# EAGLE design SparkFun_MicroPressure_Sensor (EAGLE 9.6.0)
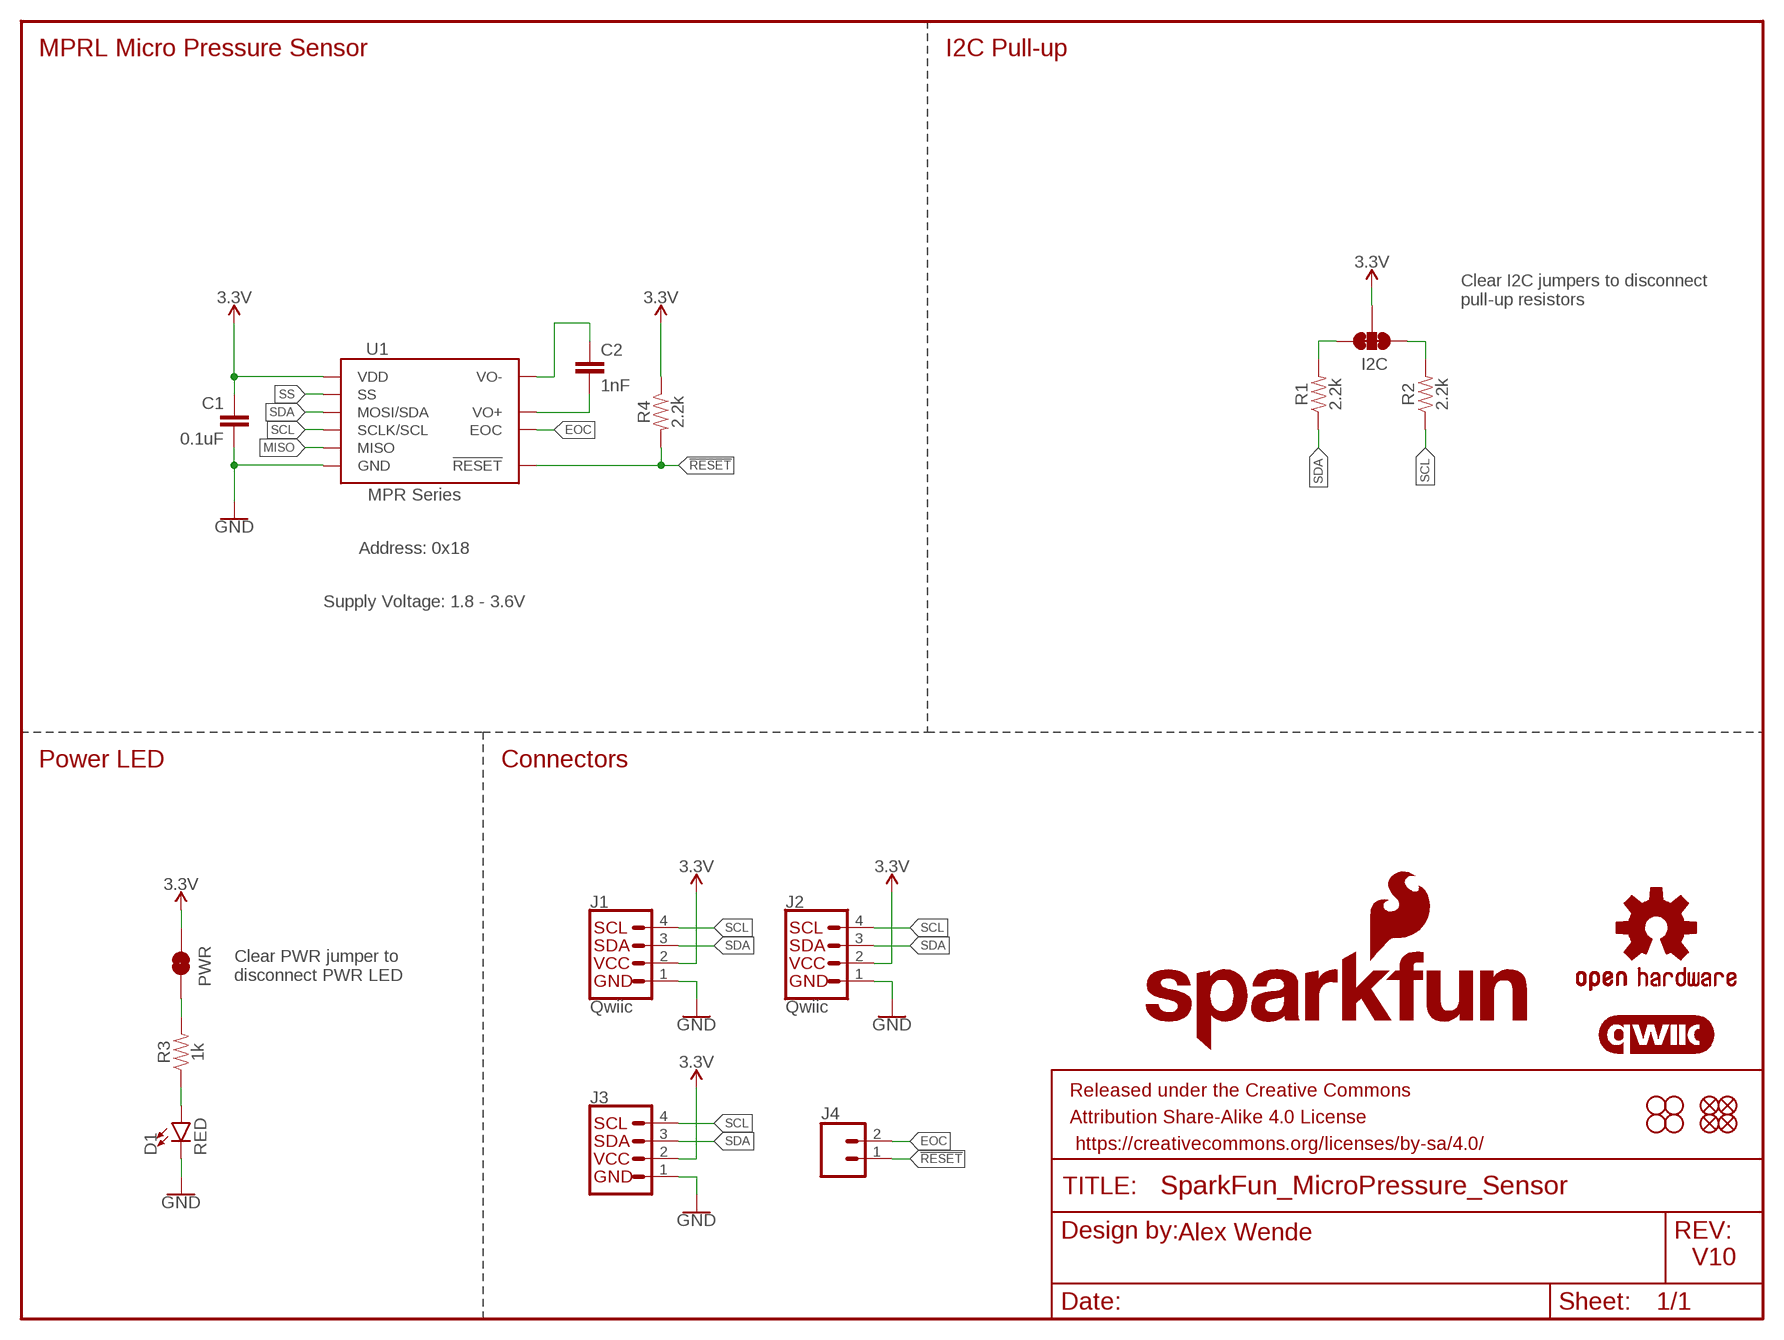
[diagram p0: schematic, sheet 1]

## Parts
C1  0.1uF  0.1UF-0603-25V-(+80/-20%)  [0603]
C2  1nF  1.0NF/1000PF-0603-50V-10%  [0603]
D1  RED  LED-RED0603  [LED-0603]
FD1  FIDUCIALUFIDUCIAL  [FIDUCIAL-MICRO]
FD2  FIDUCIALUFIDUCIAL  [FIDUCIAL-MICRO]
FD3  FIDUCIALUFIDUCIAL  [FIDUCIAL-MICRO]
FD4  FIDUCIALUFIDUCIAL  [FIDUCIAL-MICRO]
FRAME1  FRAME-LETTER  [CREATIVE_COMMONS]
H1  STAND-OFF  [STAND-OFF]
H2  STAND-OFF  [STAND-OFF]
H3  STAND-OFF  [STAND-OFF]
H4  STAND-OFF  [STAND-OFF]
I2C  JUMPER-SMT_3_2-NC_TRACE_SILK  [SMT-JUMPER_3_2-NC_TRACE_SILK]
J1  Qwiic  I2C_STANDARDQWIIC  [JST04_1MM_RA]
J2  Qwiic  I2C_STANDARDQWIIC  [JST04_1MM_RA]
J3  I2C_STANDARD_NO_SILK  [1X04_NO_SILK]
J4  CONN_021X02_NO_SILK  [1X02_NO_SILK]
LOGO1  QWIIC_LOGO_5MM  [QWIIC_5MM]
LOGO2  OSHW-LOGOS  [OSHW-LOGO-S]
LOGO3  SFE_LOGO_NAME_FLAME.1_INCH  [SFE_LOGO_NAME_FLAME_.1]
PWR  JUMPER-SMT_2_NC_TRACE_SILK  [SMT-JUMPER_2_NC_TRACE_SILK]
R1  2.2k  2.2KOHM-0603-1/10W-1%  [0603]
R2  2.2k  2.2KOHM-0603-1/10W-1%  [0603]
R3  1k  1KOHM-0603-1/10W-1%  [0603]
R4  2.2k  2.2KOHM-0603-1/10W-1%  [0603]
U1  MPR Series  MPR_SERIES_PRESSURE_I2C  [MPR_SERIES_PRESSURE_I2C]

## Nets
3.3V: C1.1 I2C.2 J1.2 J2.2 J3.2 PWR.1 R4.1 U1.12(VDD)
!RESET: J4.1 R4.2 U1.9(!RESET)
EOC: J4.2 U1.8(EOC)
GND: C1.2 D1.C J1.1 J2.1 J3.1 U1.10(GND)
MISO: U1.7(MISO)
N$1: PWR.2 R3.2
N$2: D1.A R3.1
N$3: I2C.1 R2.2
N$4: I2C.3 R1.2
N$6: C2.2 U1.4(VO+)
N$7: C2.1 U1.6(VO-)
SCL: J1.4 J2.4 J3.4 R2.1 U1.3(SCLK/SCL)
SDA: J1.3 J2.3 J3.3 R1.1 U1.2(MOSI/SDA)
SS: U1.1(SS)

## Notes on the sheet
- MPRL Micro Pressure Sensor | I2C Pull-up
- Clear I2C jumpers to disconnect
  pull-up resistors
- Address: 0x18
- Supply Voltage: 1.8 - 3.6V
- Power LED | Connectors
- Clear PWR jumper to
  disconnect PWR LED
- Alex Wende
- V10

## Library data of the parts
C1 = SparkFun-Capacitors:0.1UF: 0.1µF ceramic capacitors A capacitor is a passive two-terminal electrical component used to store electrical energy temporarily in an electric field.; PROD_ID: CAP-00810
C2 = SparkFun-Capacitors:1.0NF/1000PF: 1nF/1,000pF ceramic capacitors A capacitor is a passive two-terminal electrical component used to store electrical energy temporarily in an electric field.; PROD_ID: CAP-07886
D1 = SparkFun-LED:LED-RED: Red SMD LED Used in manufacturing of most products at SparkFun Packages: 0603 - SMD 0603 package [Product Link] <http://docs.avagotech.com/docs/AV02-0551EN> 0603 SMART - SMD 0603 SMART package ( more efficient and expensive)[Product Link] <http://www.osram-os.com/Graphics/XPic2/00077099_0.pdf> 1206 - SMD1206 package [Product Link] <https://www.sparkfun.com/datasheets/DevTools/LilyPad/Q150OVS4.pdff> SparkFun Products: Pro Mini 328 -5V <https://www.sparkfun.com/products/821> RedBoard <https://www.sparkfun.com/products/12757> IOIO-OTG <https://www.sparkfun.com/products/13613>; PROD_ID: DIO-00819
FD1-FD4 = SparkFun-Aesthetics:FIDUCIAL: Fiducial Alignment Points Point-of-reference for pick-and-place machines and other optical instruments.
FRAME1 = SparkFun-Aesthetics:FRAME-LETTER: Schematic Frame - Letter Standard 8.5x11 US Letter frame
H1-H4 = SparkFun-Hardware:STAND-OFF: Stand Off Drill holes for mechanically mounting via screws, standoffs, etc. Note: Use the keepout ring to avoid running the screw head into surrounding components. Variant Overviews STAND-OFF - Mechanical footprint for a #4 phillips button head screw. STAND-OFF-TIGHT - Mechanical footprint for a #4 phillips button head screw, Example SparkFun Products Screw - Phillips Head (1/4", 4-40, 10 pack) <https://www.sparkfun.com/products/10453> (PRT-10453) Screw - Phillips Head (1/2", 4-40, 10 pack) <https://www.sparkfun.com/products/10452> (PRT-10452) Screw - Phillips Head (3/4", 4-40, 10 pack) <https://www.sparkfun.com/products/10451> (PRT-10451) Screw - Phillips Head (1", 4-40, 10 pack) <https://www.sparkfun.com/products/10450> (PRT-10450)
I2C = SparkFun-Jumpers:JUMPER-SMT_3_2-NC_TRACE: Normally closed trace jumper (2 of 2 connections) This jumper has a trace between all three pads so they are normally closed (NC). Use a razor knife to open the connection(s). For best results follow the IPC guidelines for cutting traces: Cutout at least 0.063 mm (0.005 in). Remove all loose material to clean up the cut area. Seal the cut with an approved epoxy. Reapply solder to reclose the connection(s).
J1 J2 = SparkFun-Connectors:I2C_STANDARD: SparkFun I2C Standard Pinout Header SparkFun has standardized on a pinout for all I2C based sensor breakouts. This pinout allows I2C boards to be plugged directly into the headers on Arduino Uno compatible boards, and to be daisy chained easily. Example SparkFun Products: SparkFun Atmospheric Sensor Breakout - BME280 <https://www.sparkfun.com/products/13676> SparkFun Altitude/Pressure Sensor Breakout - MPL3115A2 <https://www.sparkfun.com/products/11084> SparkFun TOF Range Finder Sensor - VL6180 <https://www.sparkfun.com/products/12785>; PROD_ID: CONN-13694; VALUE: Qwiic Right Angle
J3 = SparkFun-Connectors:I2C_STANDARD: SparkFun I2C Standard Pinout Header SparkFun has standardized on a pinout for all I2C based sensor breakouts. This pinout allows I2C boards to be plugged directly into the headers on Arduino Uno compatible boards, and to be daisy chained easily. Example SparkFun Products: SparkFun Atmospheric Sensor Breakout - BME280 <https://www.sparkfun.com/products/13676> SparkFun Altitude/Pressure Sensor Breakout - MPL3115A2 <https://www.sparkfun.com/products/11084> SparkFun TOF Range Finder Sensor - VL6180 <https://www.sparkfun.com/products/12785>
J4 = SparkFun-Connectors:CONN_02: Multi connection point. Often used as Generic Header-pin footprint for 0.1 inch spaced/style header connections On any of the 0.1 inch spaced packages, you can populate with these: Break Away Headers - Straight <https://www.sparkfun.com/products/116> (PRT-00116) Break Away Male Headers - Right Angle <https://www.sparkfun.com/products/553> (PRT-00553) Female Headers <https://www.sparkfun.com/products/115> (PRT-00115) Break Away Headers - Machine Pin <https://www.sparkfun.com/products/117> (PRT-00117) Break Away Female Headers - Swiss Machine Pin <https://www.sparkfun.com/products/743> (PRT-00743) For SCREWTERMINALS and SPRING TERMINALS visit here: Screw Terimnals on SparkFun.com <https://www.sparkfun.com/search/results?term=Screw+Terminals> (5mm/3.5mm/2.54mm spacing) This device is also useful as a general connection point to wire up your design to another part of your project. Our various solder wires solder well into these plated through hole pads. Hook-Up Wire - Assortment (Stranded, 22 AWG) <https://www.sparkfun.com/products/11375> (PRT-11375) Hook-Up Wire - Assortment (Solid Core, 22 AWG) <https://www.sparkfun.com/products/11367> (PRT-11367) View the entire wire category on our website here <https://www.sparkfun.com/categories/141> Special notes: Molex polarized connector foot print use with: PRT-08233 with associated crimp pins and housings. 2.54_SCREWTERM for use with PRT-10571. 3.5mm Screw Terminal footprints for PRT-08084 5mm Screw Terminal footprints for use with PRT-08432
LOGO1 = SparkFun-Aesthetics:QWIIC_LOGO: Qwiic Logos for placement on schematic and PCB. The 5.5mm silk logo is best for placing next to Qwiic connector.
LOGO2 = SparkFun-Aesthetics:OSHW-LOGO: Open-Source Hardware (OSHW) Logo This logo indicates the piece of hardware it is found on incorporates a OSHW license and/or adheres to the definition of open source hardware found here: http://freedomdefined.org/OSHW
LOGO3 = SparkFun-Aesthetics:SFE_LOGO_NAME_FLAME: SparkFun Font Logo w/ Flame This is the SparkFun full logo. The logo on the schematic will always be the same size; the package variant is the height of the flame part of the logo. Default layer for the logo on the board is tSilk.
PWR = SparkFun-Jumpers:JUMPER-SMT_2_NC_TRACE: Normally closed trace jumper This jumper has a trace between two pads so it's normally closed (NC). Use a razor knife to open the connection. For best results follow the IPC guidelines for cutting traces: Cutout at least 0.063 mm (0.005 in). Remove all loose material to clean up the cut area. Seal the cut with an approved epoxy. Reapply solder to reclose the connection.
R1 R2 R4 = SparkFun-Resistors:2.2KOHM: 2.2kΩ resistor A resistor is a passive two-terminal electrical component that implements electrical resistance as a circuit element. Resistors act to reduce current flow, and, at the same time, act to lower voltage levels within circuits. - Wikipedia; PROD_ID: RES-08272
R3 = SparkFun-Resistors:1KOHM: 1kΩ resistor A resistor is a passive two-terminal electrical component that implements electrical resistance as a circuit element. Resistors act to reduce current flow, and, at the same time, act to lower voltage levels within circuits. - Wikipedia; PROD_ID: RES-07856
U1 = SparkFun-Sensors:MPR_SERIES_PRESSURE_I2C; PROD_ID: IC-15069

## Board
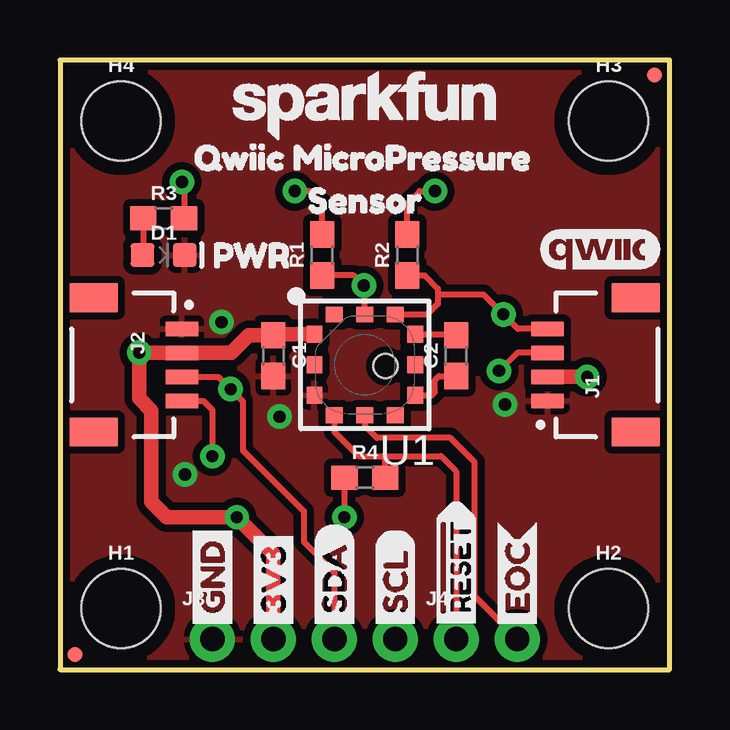
[diagram p1: board, top side]
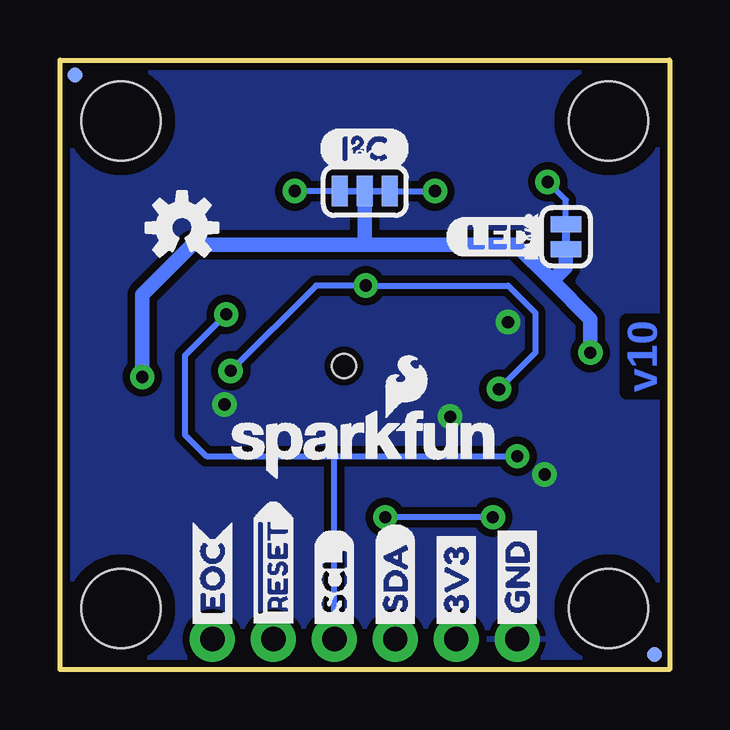
[diagram p2: board, bottom side, seen from below]

Size 25.4 x 25.4 mm. Coordinates in mm from the lower left corner, seen from the top.
Outline: 0,0 25.4,0 25.4,25.4 0,25.4 0,0
Copper layers (1*16): Top 0.035mm / dielectric 1.5mm / Bottom 0.035mm
Design rules "SparkFun-2-layer-STANDARD": minimum track width 10mil, minimum drill 20mil, track to track 10mil, track to pad 8mil, pad to pad 8mil, via to via 10mil, smd to smd 8mil, copper to edge 8mil, drill to drill 8mil, minimum pad ring 10mil, minimum via ring 10mil, stop-mask expansion 4mil, vias tented up to drill 25mil, thermal gap 10mil

### Footprints (pad centres in the part's own frame; a part is rotated, then mirrored left to right if it is on the bottom)
0603 = smd 1.1 x 1: 1 -0.85,0; 2 0.85,0
LED-0603 = smd 1 x 1: A -0.877,0; C 0.877,0
FIDUCIAL-MICRO = smd 0.635 x 0.635: 1 0,0
STAND-OFF = hole 3.302: 0,0
SMT-JUMPER_3_2-NC_TRACE_SILK = smd 0.66 x 1.27: 1 -1.041,0; 2 0,0; 3 1.041,0
JST04_1MM_RA = smd 0.6 x 1.35: 1 -1.5,0; 2 -0.5,0; 3 0.5,0; 4 1.5,0 | smd 1.2 x 2: NC1 2.8,-3.675; NC2 -2.8,-3.675
1X04_NO_SILK = drill 1.016 pad 1.88: 1 0,0; 2 2.54,0; 3 5.08,0; 4 7.62,0
1X02_NO_SILK = drill 1.016 pad 1.88: 1 0,0; 2 2.54,0
SMT-JUMPER_2_NC_TRACE_SILK = smd 0.66 x 1.27: 1 -0.521,0; 2 0.521,0
MPR_SERIES_PRESSURE_I2C = smd 0.7 x 0.65: 1 1.27,-2.1; 2 0,-2.1; 3 -1.27,-2.1; 7 -1.27,2.1; 8 0,2.1; 9 1.27,2.1 | smd 0.65 x 0.7: 4 -2.1,-1.27; 5 -2.1,0; 6 -2.1,1.27; 10 2.1,1.27; 11 2.1,0; 12 2.1,-1.27 | hole 1: -0.86,0.05

### Placement (x,y rotation side)
C1  8.89,13.08 270 top
C2  16.51,13.08 90 top
D1  4.32,17.27 0 top
FD1  0.64,0.64 0 top
FD2  0.64,0.64 0 bottom
FD3  24.77,24.77 0 bottom
FD4  24.77,24.77 0 top
FRAME1  -12.7,-17.78 0 top  (outside the outline)
H1  2.54,2.54 0 top
H2  22.86,2.54 0 top
H3  22.86,22.86 0 top
H4  2.54,22.86 0 top
I2C  12.7,19.94 0 bottom
J1  20.32,12.7 90 top
J2  5.08,12.7 270 top
J3  6.35,1.27 0 top
J4  16.51,1.27 0 top
LOGO1  22.48,17.53 0 top
LOGO2  20.32,18.41 0 bottom
LOGO3  12.7,9.4 0 bottom
PWR  4.32,18.03 90 bottom
R1  10.92,17.27 90 top
R2  14.48,17.27 90 top
R3  4.32,18.8 0 top
R4  12.7,8 0 top
U1  12.7,12.7 180 top
U$1  [GND1]  6.35,1.44 90 top
U$2  [3V30]  8.89,1.4 90 top
U$3  [SDA2]  11.43,1.44 90 top
U$4  [SCL3]  13.97,1.44 90 top
U$5  [#RESET4]  16.51,1.28 90 top
U$6  [EOC5]  19.05,1.4 90 top
U$7  [PWR0]  5.46,17.27 0 top
U$8  [LED7]  9.4,18.03 0 bottom
U$9  [I#C0]  14.61,21.72 0 bottom
U$10  [EOC5]  19.05,1.4 90 bottom
U$11  [#RESET4]  16.51,1.28 90 bottom
U$12  [SCL3]  13.97,1.44 90 bottom
U$13  [SDA2]  11.43,1.44 90 bottom
U$14  [3V30]  8.89,1.4 90 bottom
U$15  [GND1]  6.35,1.44 90 bottom
U$16  [QWIIC_MICROPRESSURE0]  4.7,21.34 0 top
U$18  [SENSOR2]  9.4,19.56 0 top
U$19  [SFE_LOGO_NAME_.1]  12.7,23.5 0 top

### Tracks (layer width: path | path; a pad name or v marks a point on that pad's centre or on a via)
3.3V  (via drill 0.51)
  Top 0.254: R4.1 v11.85,6.35
  Top 0.61: J1.2 v21.97,12.2 v21.97,12.19 | J3.2 8.89,4.83 v7.37,6.35 4.45,6.35 3.81,6.99 3.81,10.79 3.3,11.3 v3.3,13.21 v3.3,13.2 J2.2 7.14,13.2 7.87,13.93 C1.1 8.93,13.97 U1.12
  Bottom 0.254: v7.37,6.35 v11.85,6.35
  Bottom 0.61: v21.97,12.19 21.97,15.62 19.89,17.7 12.7,17.7 | 12.7,17.7 6.4,17.7 4.89,16.19 | 4.89,16.19 3.3,14.61 v3.3,13.21 | I2C.2 12.7,17.7 | PWR.1 4.32,16.76 4.89,16.19
!RESET
  Top 0.254: 13.55,8.89 12.45,8.89 11.43,9.91 U1.9 | 13.55,8.89 15.88,8.89 16.51,8.26 J4.1 | R4.2 13.55,8.89
EOC
  Top 0.254: J4.2 17.27,3.05 17.27,8.64 16.26,9.65 13.21,9.65 12.7,10.16 U1.8
GND  (via drill 0.51)
  other vias: 6.73,14.48 9.14,10.54 18.54,11.05 5.21,8.13
  pour Top (isolate 0.305): 0,0 0,25.4 25.4,25.4 25.4,0
  pour Bottom (isolate 0.305): 0,0 0,25.4 25.4,25.4 25.4,0
N$1  (via drill 0.51)
  Top 0.254: v5.08,20.32 5.17,20.23 R3.2
  Bottom 0.254: PWR.2 4.32,19.56 v5.08,20.32
N$2
  Top 0.254: R3.1 3.47,17.27 D1.A
N$3  (via drill 0.51)
  Top 0.254: R2.2 14.48,19.43 14.99,19.94 v15.62,19.94
  Bottom 0.254: I2C.1 v15.62,19.94
N$4  (via drill 0.51)
  Top 0.254: R1.2 10.92,19.43 10.41,19.94 v9.78,19.94
  Bottom 0.254: I2C.3 v9.78,19.94
N$6
  Top 0.254: C2.2 16.51,13.97 U1.4
N$7
  Top 0.254: C2.1 15.79,12.23 15.62,12.06 15.62,11.56 15.49,11.43 U1.6
SCL  (via drill 0.51)
  Top 0.254: J2.4 5.97,11.2 6.35,10.82 v6.35,8.89 | 15.75,15.62 15.75,15.24 15.31,14.8 U1.3 | J1.4 19.07,14.2 v18.47,14.8 17.65,15.62 15.75,15.62 | R2.1 15.2,16.42 15.75,15.88 15.75,15.62
  Bottom 0.254: 13.97,8.89 19.3,8.89 20.19,9.78 20.19,13.08 v18.47,14.8 | 13.97,8.89 v6.35,8.89 | J3.4 13.97,8.89
SDA  (via drill 0.51)
  Top 0.254: J2.3 6.6,12.2 v7.11,11.68 7.62,11.18 7.62,9.14 10.16,6.6 10.16,5.33 11.43,4.06 J3.3 | J1.3 19.04,13.2 v18.29,12.45 | R1.1 12.24,16.42 v12.66,16 12.7,15.96 U1.2
  Bottom 0.254: v7.11,11.68 5.59,13.21 5.59,14.86 6.73,16 v12.66,16 14.73,16 v18.29,12.45

### Text on the board
Bottom: v10
tDocu: Alex Wende